# Altium schematic sheet LO.SchDoc
size A
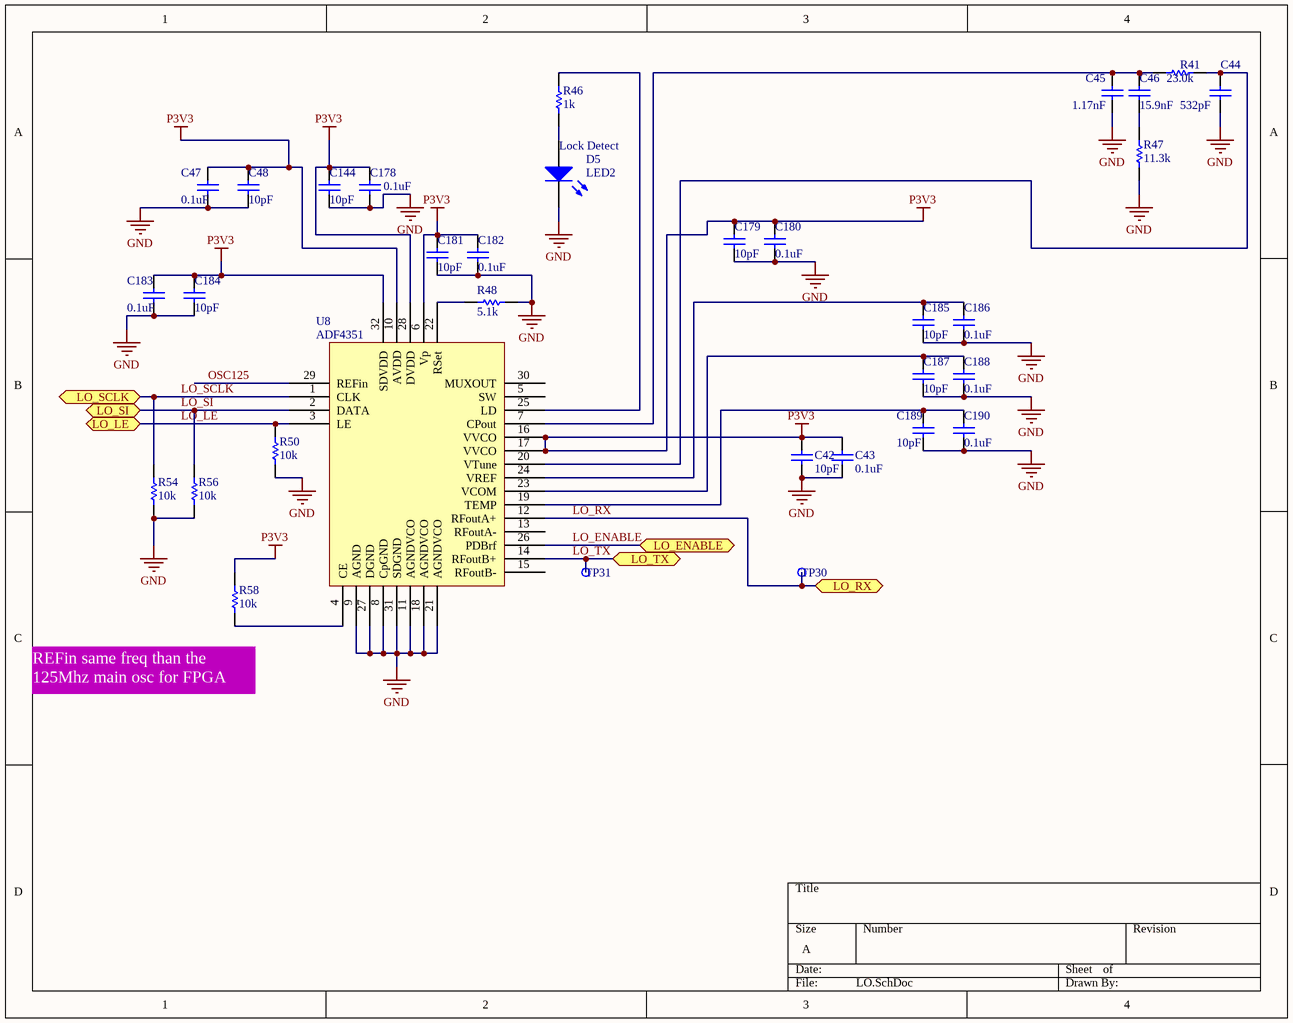
[diagram p0: LO.SchDoc]

## Parts
C42  value 10pF  [0402]  (hidden comment: Cap Semi)
C43  value 0.1uF  [0402]  (hidden comment: Cap Semi)
C44  value 532pF  [0402]  (hidden comment: Cap Semi)
C45  value 1.17nF  [0402]  (hidden comment: Cap Semi)
C46  value 15.9nF  [0402]  (hidden comment: Cap Semi)
C47  value 0.1uF  [0402]  (hidden comment: Cap Semi)
C48  value 10pF  [0402]  (hidden comment: Cap Semi)
C144  value 10pF  [0402]  (hidden comment: Cap Semi)
C178  value 0.1uF  [0402]  (hidden comment: Cap Semi)
C179  value 10pF  [0402]  (hidden comment: Cap Semi)
C180  value 0.1uF  [0402]  (hidden comment: Cap Semi)
C181  value 10pF  [0402]  (hidden comment: Cap Semi)
C182  value 0.1uF  [0402]  (hidden comment: Cap Semi)
C183  value 0.1uF  [0402]  (hidden comment: Cap Semi)
C184  value 10pF  [0402]  (hidden comment: Cap Semi)
C185  value 10pF  [0402]  (hidden comment: Cap Semi)
C186  value 0.1uF  [0402]  (hidden comment: Cap Semi)
C187  value 10pF  [0402]  (hidden comment: Cap Semi)
C188  value 0.1uF  [0402]  (hidden comment: Cap Semi)
C189  value 10pF  [0402]  (hidden comment: Cap Semi)
C190  value 0.1uF  [0402]  (hidden comment: Cap Semi)
D5  LED2  [0603]
R41  value 23.0k  [0402]  (hidden comment: Res Semi)
R46  value 1k  [0402]  (hidden comment: Res Semi)
R47  value 11.3k  [0402]  (hidden comment: Res Semi)
R48  value 5.1k  [0402]  (hidden comment: Res Semi)
R50  value 10k  [0402]  (hidden comment: Res Semi)
R54  value 10k  [0402]  (hidden comment: Res Semi)
R56  value 10k  [0402]  (hidden comment: Res Semi)
R58  value 10k  [0402]  (hidden comment: Res Semi)
TP30  LO_RX  [TPS127]  (value not drawn)
TP31  LO_TX  [TPS127]  (value not drawn)
U8  ADF4351  [ADF4350_QFN32]

## Ports
LO_ENABLE, LO_LE, LO_RX, LO_SCLK, LO_SI, LO_TX

## Nets
GND: C42.2 C43.2 C44.2 C45.2 C47.2 C48.2 C144.2 C178.2 C179.2 C180.2 C181.2 C182.2 C183.2 C184.2 C185.2 C186.2 C187.2 C188.2 C189.2 C190.2 D5.2(K) R47.2 R48.1 R50.2 R54.2 R56.2 U8.8(CpGND) U8.9(AGND) U8.11(AGNDVCO) U8.18(AGNDVCO) U8.21(AGNDVCO) U8.27(DGND) U8.31(SDGND)
P3V3: C42.1 C43.1 C47.1 C48.1 C144.1 C178.1 C179.1 C180.1 C181.1 C182.1 C183.1 C184.1 R58.1 U8.6(Vp) U8.10(AVDD) U8.16(VVCO) U8.17(VVCO) U8.28(DVDD) U8.32(SDVDD)
LO_ENABLE: U8.26(PDBrf) ; port LO_ENABLE
LO_LE: R50.1 U8.3(LE) ; port LO_LE
LO_RX: TP30.1 U8.12(RFoutA+) ; port LO_RX
LO_SCLK: R54.1 U8.1(CLK) ; port LO_SCLK
LO_SI: R56.1 U8.2(DATA) ; port LO_SI
LO_TX: TP31.1 U8.14(RFoutB+) ; port LO_TX
OSC125: U8.29(REFin)
NetC44_1: C44.1 R41.1 U8.20(VTune)
NetC45_1: C45.1 C46.1 R41.2 U8.7(CPout)
NetC46_2: C46.2 R47.1
NetC185_1: C185.1 C186.1 U8.24(VREF)
NetC187_1: C187.1 C188.1 U8.23(VCOM)
NetC189_1: C189.1 C190.1 U8.19(TEMP)
NetD5_1: D5.1(A) R46.2
NetR46_1: R46.1 U8.25(LD)
NetR48_2: R48.2 U8.22(RSet)
NetR58_2: R58.2 U8.4(CE)

Not connected (* = marked no-connect by the designer): U8 5(SW) 13(RFoutA-) 15(RFoutB-) 30(MUXOUT)

## Notes on the sheet
- (near D5) Lock Detect
- (near R58) REFin same freq than the 125Mhz main osc for FPGA

## Library data of the parts
C42-C48 C144 C178-C190 = Cap Semi: Capacitor (Semiconductor SIM Model); Published: 8-Jun-2000; LatestRevisionDate: 29-May-2009; LatestRevisionNote: IPC-7351 Footprint Added.; PackageReference: C1206; Publisher: Altium Limited; PackageDescription: Chip Capacitor
D5 = LED2: Typical RED, GREEN, YELLOW, AMBER GaAs LED; Published: 8-Jun-2000; LatestRevisionDate: 17-Jul-2002; LatestRevisionNote: Re-released for DXP Platform.; PackageVersion: Feb-2002; PackageReference: 3.2X1.6X1.1; Publisher: Altium Limited; PackageDescription: SM LED; 2 Flat Leads
R41 R46-R48 R50 R54 R56 R58 = Res Semi: Semiconductor Resistor; Published: 8-Jun-2000; LatestRevisionDate: 17-Jul-2002; LatestRevisionNote: Re-released for DXP Platform.; PackageReference: AXIAL-0.5; Publisher: Altium Limited; PackageDescription: Axial Device, Thru-Hole; 2 Leads; 0.5 in Pin Spacing
TP30 TP31 = SMD_PAD_1.27X1.27MM: Test Point; Part Description: 1.27mm x 1.27mm PCB Copper Area (SMD Test Point); Mounted: No; Part Number: SMD_PAD_1.27X1.27MM; Component Kind: Standard (No BOM); Component Type: Standard (No BOM); Pin Count: 1; Family: Test Point; Socket: No; SMD: Yes; Sense: No; Status: None; ComponentHeight: 0mm; HelpURL: Undefined; Author: CERN DEM JLC; CreateDate: 12.01.2008; LatestRevisionDate: 12.01.2008; PackageDescription: 1.27mm x 1.27mm PCB Copper Area (SMD Test Point)
U8 = ADF4350: VCO; PackageReference: QFN-32 ( LFCSP-32 ) ADF4351BCPZ